# EAGLE schematic OneWire eksempel (EAGLE 7.5.0)
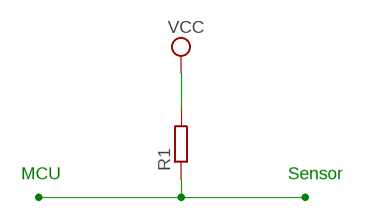
[diagram p0: schematic, sheet 1]

## Parts
R1  R-EU_0204/7  [0204/7]

## Nets
N$1: R1.1
VCC: R1.2

## Notes on the sheet
- MCU | Sensor

## Library data of the parts
R1 = resistor:R-EU_: RESISTOR, European symbol